# Altium project ActuatorBoard_CAN.PrjPcb
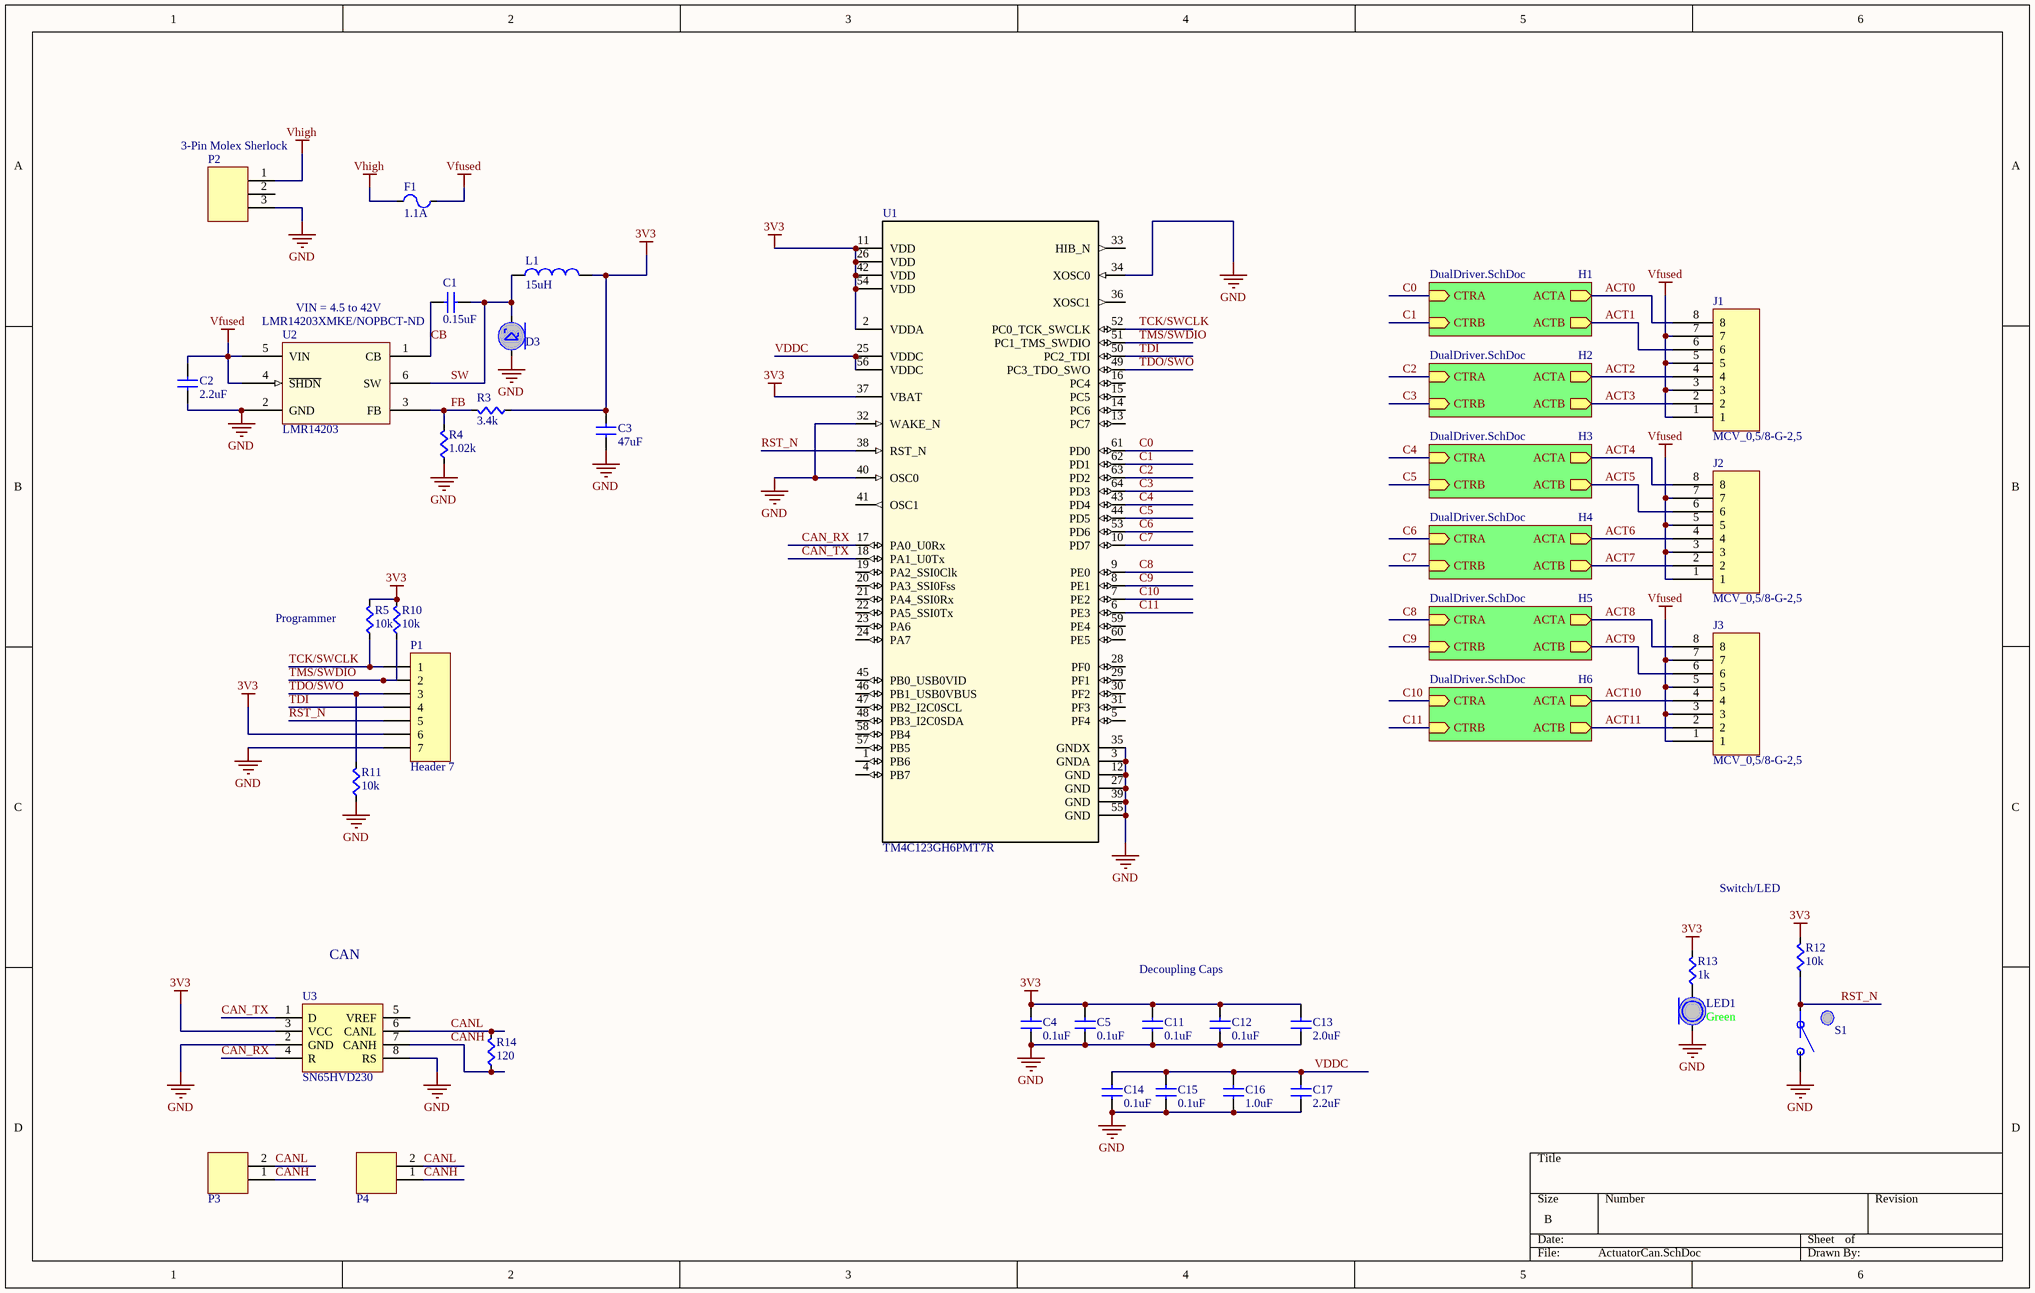
[diagram p0: ActuatorCan.SchDoc]
2 sheets, 65 parts. Net scope: hierarchical (ports join the sheet entries above them; power ports are global).
Board file: ActuatorCan.PcbDoc
Sheets:
  ActuatorCan.SchDoc
    H1 = DualDriver.SchDoc
    H2 = DualDriver.SchDoc
    H3 = DualDriver.SchDoc
    H4 = DualDriver.SchDoc
    H5 = DualDriver.SchDoc
    H6 = DualDriver.SchDoc

## Sheet ActuatorCan.SchDoc
size B

### Parts
C1  value 0.15uF  [CAPC0603]  (hidden comment: Cap)
C2  value 2.2uF  [CAPC0805]  (hidden comment: Cap)
C3  value 47uF  [CAPC1206]  (hidden comment: Cap)
C4  value 0.1uF  [CAPC0603]  (hidden comment: Cap)
C5  value 0.1uF  [CAPC0603]  (hidden comment: Cap)
C11  value 0.1uF  [CAPC0603]  (hidden comment: Cap)
C12  value 0.1uF  [CAPC0603]  (hidden comment: Cap)
C13  value 2.0uF  [CAPC0603]  (hidden comment: Cap)
C14  value 0.1uF  [CAPC0603]  (hidden comment: Cap)
C15  value 0.1uF  [CAPC0603]  (hidden comment: Cap)
C16  value 1.0uF  [CAPC0603]  (hidden comment: Cap)
C17  value 2.2uF  [CAPC0603]  (hidden comment: Cap)
D3  Schottky  [1N5819HW-7-F]  (value not drawn)
F1  value 1.1A  [PTC7451X11N]  (hidden comment: PTC Fuse)
J1  MCV_0,5/8-G-2,5  [MCV_0,5/8-G-2,5]
J2  MCV_0,5/8-G-2,5  [MCV_0,5/8-G-2,5]
J3  MCV_0,5/8-G-2,5  [MCV_0,5/8-G-2,5]
L1  Inductance: 15uH  [NS10165T150MNA]  (hidden comment: Inductor)
LED1  Color: Green  [LED0603]  (hidden comment: LED)
P1  Header 7  [HDR1X7]
P2  3-Pin Molex Sherlock  [MOLEX-HDR-1X3-SHERLOCK-VERT]
P3  2-pin Horz Sherlock  [MOLEX-HDR-1X2-SHERLOCK-HORZ]  (value not drawn)
P4  2-pin Horz Sherlock  [MOLEX-HDR-1X2-SHERLOCK-HORZ]  (value not drawn)
R3  value 3.4k  [RES0603]  (hidden comment: Res)
R4  value 1.02k  [RES0603]  (hidden comment: Res)
R5  value 10k  [RES0603]  (hidden comment: Res)
R10  value 10k  [RES0603]  (hidden comment: Res)
R11  value 10k  [RES0603]  (hidden comment: Res)
R12  value 10k  [RES0603]  (hidden comment: Res)
R13  value 1k  [RES0603]  (hidden comment: Res)
R14  value 120  [RES0603]  (hidden comment: Res)
S1  Button  [PTS645xxxxSMTR92]  (value not drawn)
U1  TM4C123GH6PMT7R  [PM0064A_N]
U2  LMR14203  Supplier Part Number 1: LMR14203XMKE/NOPBCT-ND  [SOT95P280X110-6N]
U3  SN65HVD230  [SOIC-8pin]

### Sub-sheets
H1 = DualDriver.SchDoc: ACTA (out), CTRA (in), ACTB (out), CTRB (in)
H2 = DualDriver.SchDoc: ACTA (out), CTRA (in), ACTB (out), CTRB (in)
H3 = DualDriver.SchDoc: ACTA (out), CTRA (in), ACTB (out), CTRB (in)
H4 = DualDriver.SchDoc: ACTA (out), CTRA (in), ACTB (out), CTRB (in)
H5 = DualDriver.SchDoc: ACTA (out), CTRA (in), ACTB (out), CTRB (in)
H6 = DualDriver.SchDoc: ACTA (out), CTRA (in), ACTB (out), CTRB (in)

### Nets
3V3: C3.2(B) C4.1(A) C5.1(A) C11.1(A) C12.1(A) C13.1(A) L1.2(B) P1.6 R3.2(B) R5.1(A) R10.1(A) R12.1(A) R13.1(A) U1.2(VDDA) U1.11(VDD) U1.26(VDD) U1.37(VBAT) U1.42(VDD) U1.54(VDD) U3.3(VCC)
GND: C2.1(A) C3.1(A) C4.2(B) C5.2(B) C11.2(B) C12.2(B) C13.2(B) C14.2(B) C15.2(B) C16.2(B) C17.2(B) D3.A LED1.C P1.7 P2.3 R4.2(B) R11.2(B) S1.B U1.3(GNDA) U1.12(GND) U1.27(GND) U1.32(WAKE_N) U1.34(XOSC0) U1.35(GNDX) U1.39(GND) U1.40(OSC0) U1.55(GND) U2.2(GND) U3.2(GND) U3.8(RS)
Vfused: C2.2(B) F1.2(B) J1.1 J1.3 J1.5 J1.7 J2.1 J2.3 J2.5 J2.7 J3.1 J3.3 J3.5 J3.7 U2.4(~{SHDN}) U2.5(VIN)
Vhigh: F1.1(A) P2.1
ACT0: J1.8 ; sheet H1/ACTA
ACT1: J1.6 ; sheet H1/ACTB
ACT2: J1.4 ; sheet H2/ACTA
ACT3: J1.2 ; sheet H2/ACTB
ACT4: J2.8 ; sheet H3/ACTA
ACT5: J2.6 ; sheet H3/ACTB
ACT6: J2.4 ; sheet H4/ACTA
ACT7: J2.2 ; sheet H4/ACTB
ACT8: J3.8 ; sheet H5/ACTA
ACT9: J3.6 ; sheet H5/ACTB
ACT10: J3.4 ; sheet H6/ACTA
ACT11: J3.2 ; sheet H6/ACTB
C0: U1.61(PD0) ; sheet H1/CTRA
C1: U1.62(PD1) ; sheet H1/CTRB
C2: U1.63(PD2) ; sheet H2/CTRA
C3: U1.64(PD3) ; sheet H2/CTRB
C4: U1.43(PD4) ; sheet H3/CTRA
C5: U1.44(PD5) ; sheet H3/CTRB
C6: U1.53(PD6) ; sheet H4/CTRA
C7: U1.10(PD7) ; sheet H4/CTRB
C8: U1.9(PE0) ; sheet H5/CTRA
C9: U1.8(PE1) ; sheet H5/CTRB
C10: U1.7(PE2) ; sheet H6/CTRA
C11: U1.6(PE3) ; sheet H6/CTRB
CAN_RX: U1.17(PA0_U0Rx) U3.4(R)
CAN_TX: U1.18(PA1_U0Tx) U3.1(D)
CANH: P3.1 P4.1 R14.2(B) U3.7(CANH)
CANL: P3.2 P4.2 R14.1(A) U3.6(CANL)
CB: C1.1(A) U2.1(CB)
FB: R3.1(A) R4.1(A) U2.3(FB)
RST_N: P1.5 R12.2(B) S1.A U1.38(RST_N)
SW: C1.2(B) D3.C L1.1(A) U2.6(SW)
TCK/SWCLK: P1.1 R5.2(B) U1.52(PC0_TCK_SWCLK)
TDI: P1.4 U1.50(PC2_TDI)
TDO/SWO: P1.3 R11.1(A) U1.49(PC3_TDO_SWO)
TMS/SWDIO: P1.2 R10.2(B) U1.51(PC1_TMS_SWDIO)
VDDC: C14.1(A) C15.1(A) C16.1(A) C17.1(A) U1.25(VDDC) U1.56(VDDC)
NetLED1_A: LED1.A R13.2(B)

Not connected (* = marked no-connect by the designer): P2 2; U1 1(PB6) 4(PB7) 5(PF4) 13(PC7) 14(PC6) 15(PC5) 16(PC4) 19(PA2_SSI0Clk) 20(PA3_SSI0Fss) 21(PA4_SSI0Rx) 22(PA5_SSI0Tx) 23(PA6) 24(PA7) 28(PF0) 29(PF1) 30(PF2) 31(PF3) 33(HIB_N) 36(XOSC1) 41(OSC1) 45(PB0_USB0VID) 46(PB1_USB0VBUS) 47(PB2_I2C0SCL) 48(PB3_I2C0SDA) 57(PB5) 58(PB4) 59(PE4) 60(PE5); U3 5(VREF)

### Notes on the sheet
- VIN = 4.5 to 42V
- (near R5) Programmer
- Switch/LED
- CAN
- Decoupling Caps

### Library data of the parts
D3 = Schottky: Schottky Diode Template; Supplier Part Number 1: 1N5819HW-FDICT-ND; Supplier 1: Digi-Key
F1 = PTC_Fuse: Supplier 1: Digi-Key; Supplier Part Number 1: 507-1744-1-ND
J1-J3 = MCV_0,5/8-G-2,5: CONN TERM BLOCK 2.50MM 8POS, Vertical, Through-Hole, 4A; Supplier 1: Digi-Key; Supplier Part Number 1: 277-1458-ND; Mating Conn. Digi-Key P/N: 277-1436-ND
P1 = Header 7: Header, 7-Pin; LatestRevisionDate: 17-Jul-2002; LatestRevisionNote: Re-released for DXP Platform.; Publisher: Altium Limited
P2 = MOLEX-HDR-1x3-SHERLOCK_VERT: Header, Molex, 2mm Pitch Sherlock Header, Single Row, Vertical, 3 Circuits, Length 3.3mm, 0353620376; Manufacturer Part Number: *; Order Part Number: *
P3 P4 = MOLEX-HDR-1x2-SHERLOCK_RA: Header, Molex, 2mm Pitch Sherlock Header, Single Row, Horizontal, 2 Circuits, Length 3.3mm,  0353630260; Manufacturer: Molex Inc; Manufacturer Part Number: 0353630260; Supplier Part Number 1: WM18931-ND; Supplier 1: Digi-Key
S1 = Button: SPST Button; Supplier 1: Digi-Key; Supplier Part Number 1: CKN9087CT-ND
U1 = TM4C123GH6PMT7R: Imported; PartNumber: TM4C123GH6PMTR; Manufacturer: Texas Instruments; CompType: IC; PIN_COUNT: 64; Application_BuildNumber: *; Alternate_PartNumber: TM4C123GH6PMT; PackageReference: PM0064A; MountType: SMT; RoHS: Y; RefDes: RefDes; TYPE: TYPE; Value: Value
U2 = LMR14203: Simple Switcher 42Vin 0.3A Step-Down Voltage Regulator; Supplier 1: Digi-Key
U3 = SN65HVD230: 3.3V CAN Bus Transceiver
C1-C5 C11-C17 = Cap: Supplier 1: Digi-Key
  C1: Supplier Part Number 1: 445-13339-1-ND
  C2: Supplier Part Number 1: 445-5968-1-ND
  C3: Supplier Part Number 1: 399-5508-1-ND
  C4 C5 C11-C17: Supplier Part Number 1: 1276-1000-1-ND
L1 = Inductor: Supplier 1: Digi-Key; Supplier Part Number 1: 445-4574-1-ND
LED1 = LED: Supplier 1: Digi-Key; Supplier Part Number 1: 754-1122-1-ND
R3-R5 R10-R14 = Res: Supplier 1: Digi-Key
  R3: Supplier Part Number 1: 311-3.40KHRCT-ND
  R4: Supplier Part Number 1: 311-1.02KHRCT-ND
  R5 R10-R13: Supplier Part Number 1: RMCF0603JT10K0CT-ND

## Sheet DualDriver.SchDoc
size Letter
Used 6 times, as channels H1, H2, H3, H4, H5, H6. Parts and nets are listed once, with the designators drawn on the sheet.
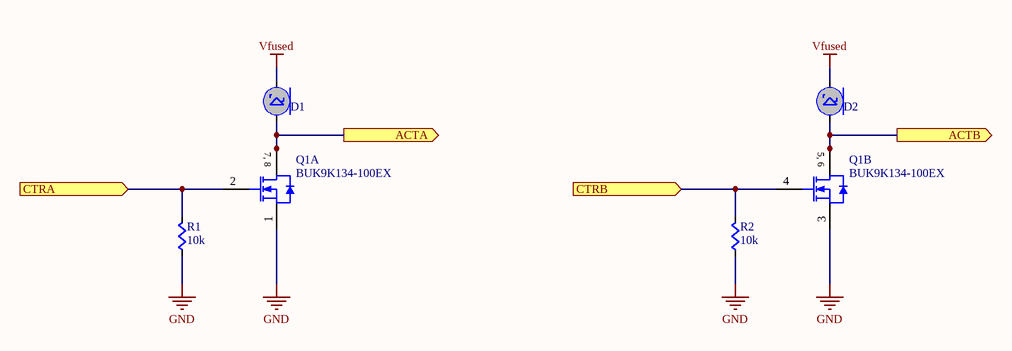
[diagram p1: DualDriver.SchDoc]

### Parts
D1  Schottky  [SS110-TP]  (value not drawn)
D2  Schottky  [SS110-TP]  (value not drawn)
Q1  BUK9K134-100EX  [NXP_SOT1205]  (parts A,B of 2)
R1  value 10k  [RES0603]  (hidden comment: Res)
R2  value 10k  [RES0603]  (hidden comment: Res)

### Ports
ACTA (out), ACTB (out), CTRA (in), CTRB (in)

### Nets
GND: Q1.1(S) Q1.3(S) R1.2(B) R2.2(B)
Vfused: D1.C D2.C
ACTA: D1.A Q1.7(D) Q1.8(D) ; port ACTA
ACTB: D2.A Q1.5(D) Q1.6(D) ; port ACTB
CTRA: Q1.2(G) R1.1(A) ; port CTRA
CTRB: Q1.4(G) R2.1(A) ; port CTRB

### Channels
H1: designators end in #1; ports ACTA=ACT0 ACTB=ACT1 CTRA=C0 CTRB=C1
H2: designators end in #2; ports ACTA=ACT2 ACTB=ACT3 CTRA=C2 CTRB=C3
H3: designators end in #3; ports ACTA=ACT4 ACTB=ACT5 CTRA=C4 CTRB=C5
H4: designators end in #4; ports ACTA=ACT6 ACTB=ACT7 CTRA=C6 CTRB=C7
H5: designators end in #5; ports ACTA=ACT8 ACTB=ACT9 CTRA=C8 CTRB=C9
H6: designators end in #6; ports ACTA=ACT10 ACTB=ACT11 CTRA=C10 CTRB=C11

### Notes on the sheet
- (in symbol BUK9K134-100EX, part A) 7, 8
- (in symbol BUK9K134-100EX, part B) 5, 6

### Library data of the parts
D1 D2 = Schottky: Schottky Diode Template; Supplier 1: Digi-Key; Supplier Part Number 1: B1100-FDICT-ND
Q1 = BUK9K134-100EX: MOSFET DUAL N-CH 100V 8.5A SOT1205; Supplier 1: Digi-Key; Supplier Part Number 1: 568-11631-1-ND
R1 R2 = Res: Supplier 1: Digi-Key; Supplier Part Number 1: 311-10.0KHRCT-ND

## Nets that join several sheets
GND: ActuatorCan (30 pins), H1 (Q1#1.1 Q1#1.3 R1#1.2 R2#1.2), H2 (Q1#2.1 Q1#2.3 R1#2.2 R2#2.2), H3 (Q1#3.1 Q1#3.3 R1#3.2 R2#3.2), H4 (Q1#4.1 Q1#4.3 R1#4.2 R2#4.2), H5 (Q1#5.1 Q1#5.3 R1#5.2 R2#5.2), H6 (Q1#6.1 Q1#6.3 R1#6.2 R2#6.2)
Vfused: ActuatorCan (16 pins), H1 (D1#1.C D2#1.C), H2 (D1#2.C D2#2.C), H3 (D1#3.C D2#3.C), H4 (D1#4.C D2#4.C), H5 (D1#5.C D2#5.C), H6 (D1#6.C D2#6.C)
ACT0: ActuatorCan (J1.8), H1 (D1#1.A Q1#1.7 Q1#1.8)
ACT1: ActuatorCan (J1.6), H1 (D2#1.A Q1#1.5 Q1#1.6)
ACT2: ActuatorCan (J1.4), H2 (D1#2.A Q1#2.7 Q1#2.8)
ACT3: ActuatorCan (J1.2), H2 (D2#2.A Q1#2.5 Q1#2.6)
ACT4: ActuatorCan (J2.8), H3 (D1#3.A Q1#3.7 Q1#3.8)
ACT5: ActuatorCan (J2.6), H3 (D2#3.A Q1#3.5 Q1#3.6)
ACT6: ActuatorCan (J2.4), H4 (D1#4.A Q1#4.7 Q1#4.8)
ACT7: ActuatorCan (J2.2), H4 (D2#4.A Q1#4.5 Q1#4.6)
ACT8: ActuatorCan (J3.8), H5 (D1#5.A Q1#5.7 Q1#5.8)
ACT9: ActuatorCan (J3.6), H5 (D2#5.A Q1#5.5 Q1#5.6)
ACT10: ActuatorCan (J3.4), H6 (D1#6.A Q1#6.7 Q1#6.8)
ACT11: ActuatorCan (J3.2), H6 (D2#6.A Q1#6.5 Q1#6.6)
C0: ActuatorCan (U1.61), H1 (Q1#1.2 R1#1.1)
C1: ActuatorCan (U1.62), H1 (Q1#1.4 R2#1.1)
C2: ActuatorCan (U1.63), H2 (Q1#2.2 R1#2.1)
C3: ActuatorCan (U1.64), H2 (Q1#2.4 R2#2.1)
C4: ActuatorCan (U1.43), H3 (Q1#3.2 R1#3.1)
C5: ActuatorCan (U1.44), H3 (Q1#3.4 R2#3.1)
C6: ActuatorCan (U1.53), H4 (Q1#4.2 R1#4.1)
C7: ActuatorCan (U1.10), H4 (Q1#4.4 R2#4.1)
C8: ActuatorCan (U1.9), H5 (Q1#5.2 R1#5.1)
C9: ActuatorCan (U1.8), H5 (Q1#5.4 R2#5.1)
C10: ActuatorCan (U1.7), H6 (Q1#6.2 R1#6.1)
C11: ActuatorCan (U1.6), H6 (Q1#6.4 R2#6.1)